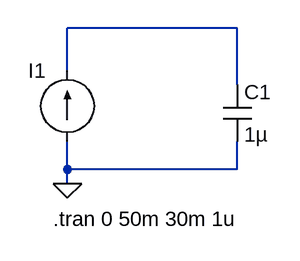
[diagram p0: schematic capacitorthingy.asc]
capacitorthingy.asc, the LTspice schematic file:
Version 4
SHEET 1 880 680
WIRE 496 224 304 224
WIRE 304 272 304 224
WIRE 496 288 496 224
WIRE 304 384 304 352
WIRE 496 384 496 352
WIRE 496 384 304 384
WIRE 304 400 304 384
FLAG 304 400 0
SYMBOL current 304 352 R180
WINDOW 0 24 80 Left 2
WINDOW 3 24 0 Invisible 2
SYMATTR InstName I1
SYMATTR Value SINE(0 1mA 100Hz)
SYMBOL cap 480 288 R0
SYMATTR InstName C1
SYMATTR Value 1µ
TEXT 288 440 Left 2 !.tran 0 50m 30m 1u

The netlist it stands for:
* capacitorthingy.asc
I1 0 N001 SINE(0 1mA 100Hz)
C1 N001 0 1µ
.tran 0 50m 30m 1u
.backanno
.end